# Altium project MiniProject.PrjPcb
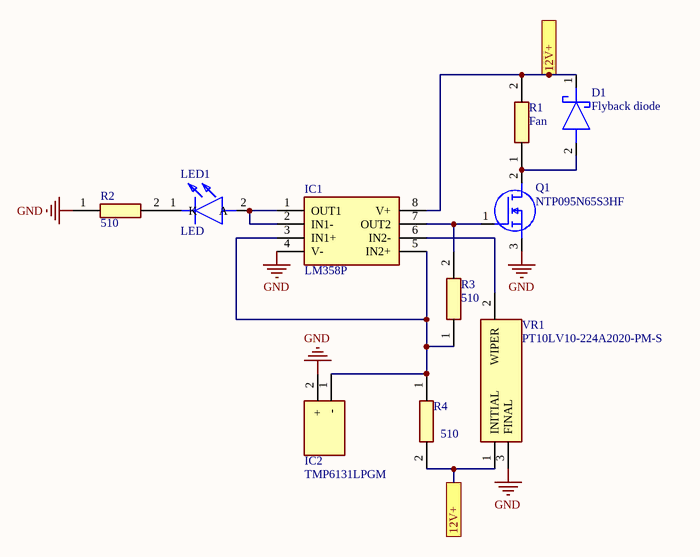
[diagram p0: Mini_project.SchDoc]
1 sheet, 10 parts. Net scope: flat (ports and power ports of the same name join across sheets).
Board file: mini_project_pcb.PcbDoc

## Sheet Mini_project.SchDoc
size A

### Parts
D1  Flyback diode  [DIOAD950W60L350D150]
IC1  LM358P  [DIP794W53P254L959H508Q8N]
IC2  TMP6131LPGM  [LMT01QLPGQ1]
LED1  LED  [C543AWMNCCCKK141]
Q1  NTP095N65S3HF  [TO254P470X1016X2019-3P]
R1  Fan  [RESAD3750W83L1670D520]
R2  510  [RESAD3750W83L1670D520]
R3  510  [RESAD3750W83L1670D520]
R4  510  [RESAD3750W83L1670D520]
VR1  PT10LV10-224A2020-PM-S  [PT10LV10224A2020PMS]

### Ports
12V+

### Nets
GND: IC1.4(V-) IC2.2(+) Q1.3(S) R2.1 VR1.3(FINAL)
NetD1_1: D1.1(K) IC1.8(V+) R1.2 R4.2 VR1.1(INITIAL) ; port 12V+
NetD1_2: D1.2(A) Q1.2(D) R1.1
NetIC1_1: IC1.1(OUT1) IC1.2(IN1-) LED1.2(A)
NetIC1_3: IC1.3(IN1+) IC1.5(IN2+) IC2.1(-) R3.1 R4.1
NetIC1_6: IC1.6(IN2-) VR1.2(WIPER)
NetIC1_7: IC1.7(OUT2) Q1.1(G) R3.2
NetLED1_1: LED1.1(K) R2.2

### Library data of the parts
D1 = SD101A-TR: Manufacturer_Name: Vishay; Datasheet Link: https://componentsearchengine.com/Datasheets/5/SD101A-TR.pdf; Manufacturer_Part_Number: SD101A-TR
IC1 = LM358P: Integrated Circuit; Manufacturer_Name: Texas Instruments; Datasheet Link: http://www.ti.com/lit/ds/symlink/lm358a.pdf; Height: 5.08mm; Mouser2 Part Number: 595-LM358P; Mouser2 Price/Stock: https://www.mouser.com/Search/Refine.aspx?Keyword=595-LM358P; Manufacturer_Part_Number: LM358P
IC2 = TMP6131LPGM: Integrated Circuit; Manufacturer_Name: Texas Instruments; Datasheet Link: https://www.ti.com/lit/gpn/TMP61; Height: 5.3mm; Manufacturer_Part_Number: TMP6131LPGM
LED1 = C543A-WMN-CCCKK141: Manufacturer_Name: Cree; Datasheet Link: https://componentsearchengine.com//C543A-WMN-CCCKK141.pdf; Height: 8.7mm; Mouser2 Part Number: 941-C543AWMNCCCKK141; Mouser2 Price/Stock: https://www.mouser.com/Search/Refine.aspx?Keyword=941-C543AWMNCCCKK141; Manufacturer_Part_Number: C543A-WMN-CCCKK141
Q1 = NTP095N65S3HF: MOSFET (N-Channel); Manufacturer_Name: ON Semiconductor; Datasheet Link: https://componentsearchengine.com//NTP095N65S3HF.pdf; Height: 4.7mm; Mouser2 Part Number: 863-NTP095N65S3HF; Mouser2 Price/Stock: https://www.mouser.com/Search/Refine.aspx?Keyword=863-NTP095N65S3HF; Manufacturer_Part_Number: NTP095N65S3HF
R1-R4 = PR03000205100JAC00: Manufacturer_Name: Vishay; Datasheet Link: http://www.vishay.com/docs/28729/pr010203.pdf; Manufacturer_Part_Number: PR03000205100JAC00
VR1 = PT10LV10-224A2020-PM-S: Variable Resistor; Manufacturer_Name: PIHER; Datasheet Link: https://componentsearchengine.com//PT10LV10-224A2020-PM-S.pdf; Height: 4.8mm; Mouser2 Part Number: 531-PT1LV1224A22PMS; Mouser2 Price/Stock: https://www.mouser.com/Search/Refine.aspx?Keyword=531-PT1LV1224A22PMS; Manufacturer_Part_Number: PT10LV10-224A2020-PM-S